# Altium schematic sheet P07_DDR3 Memory.SchDoc
size 386 x 246 mm
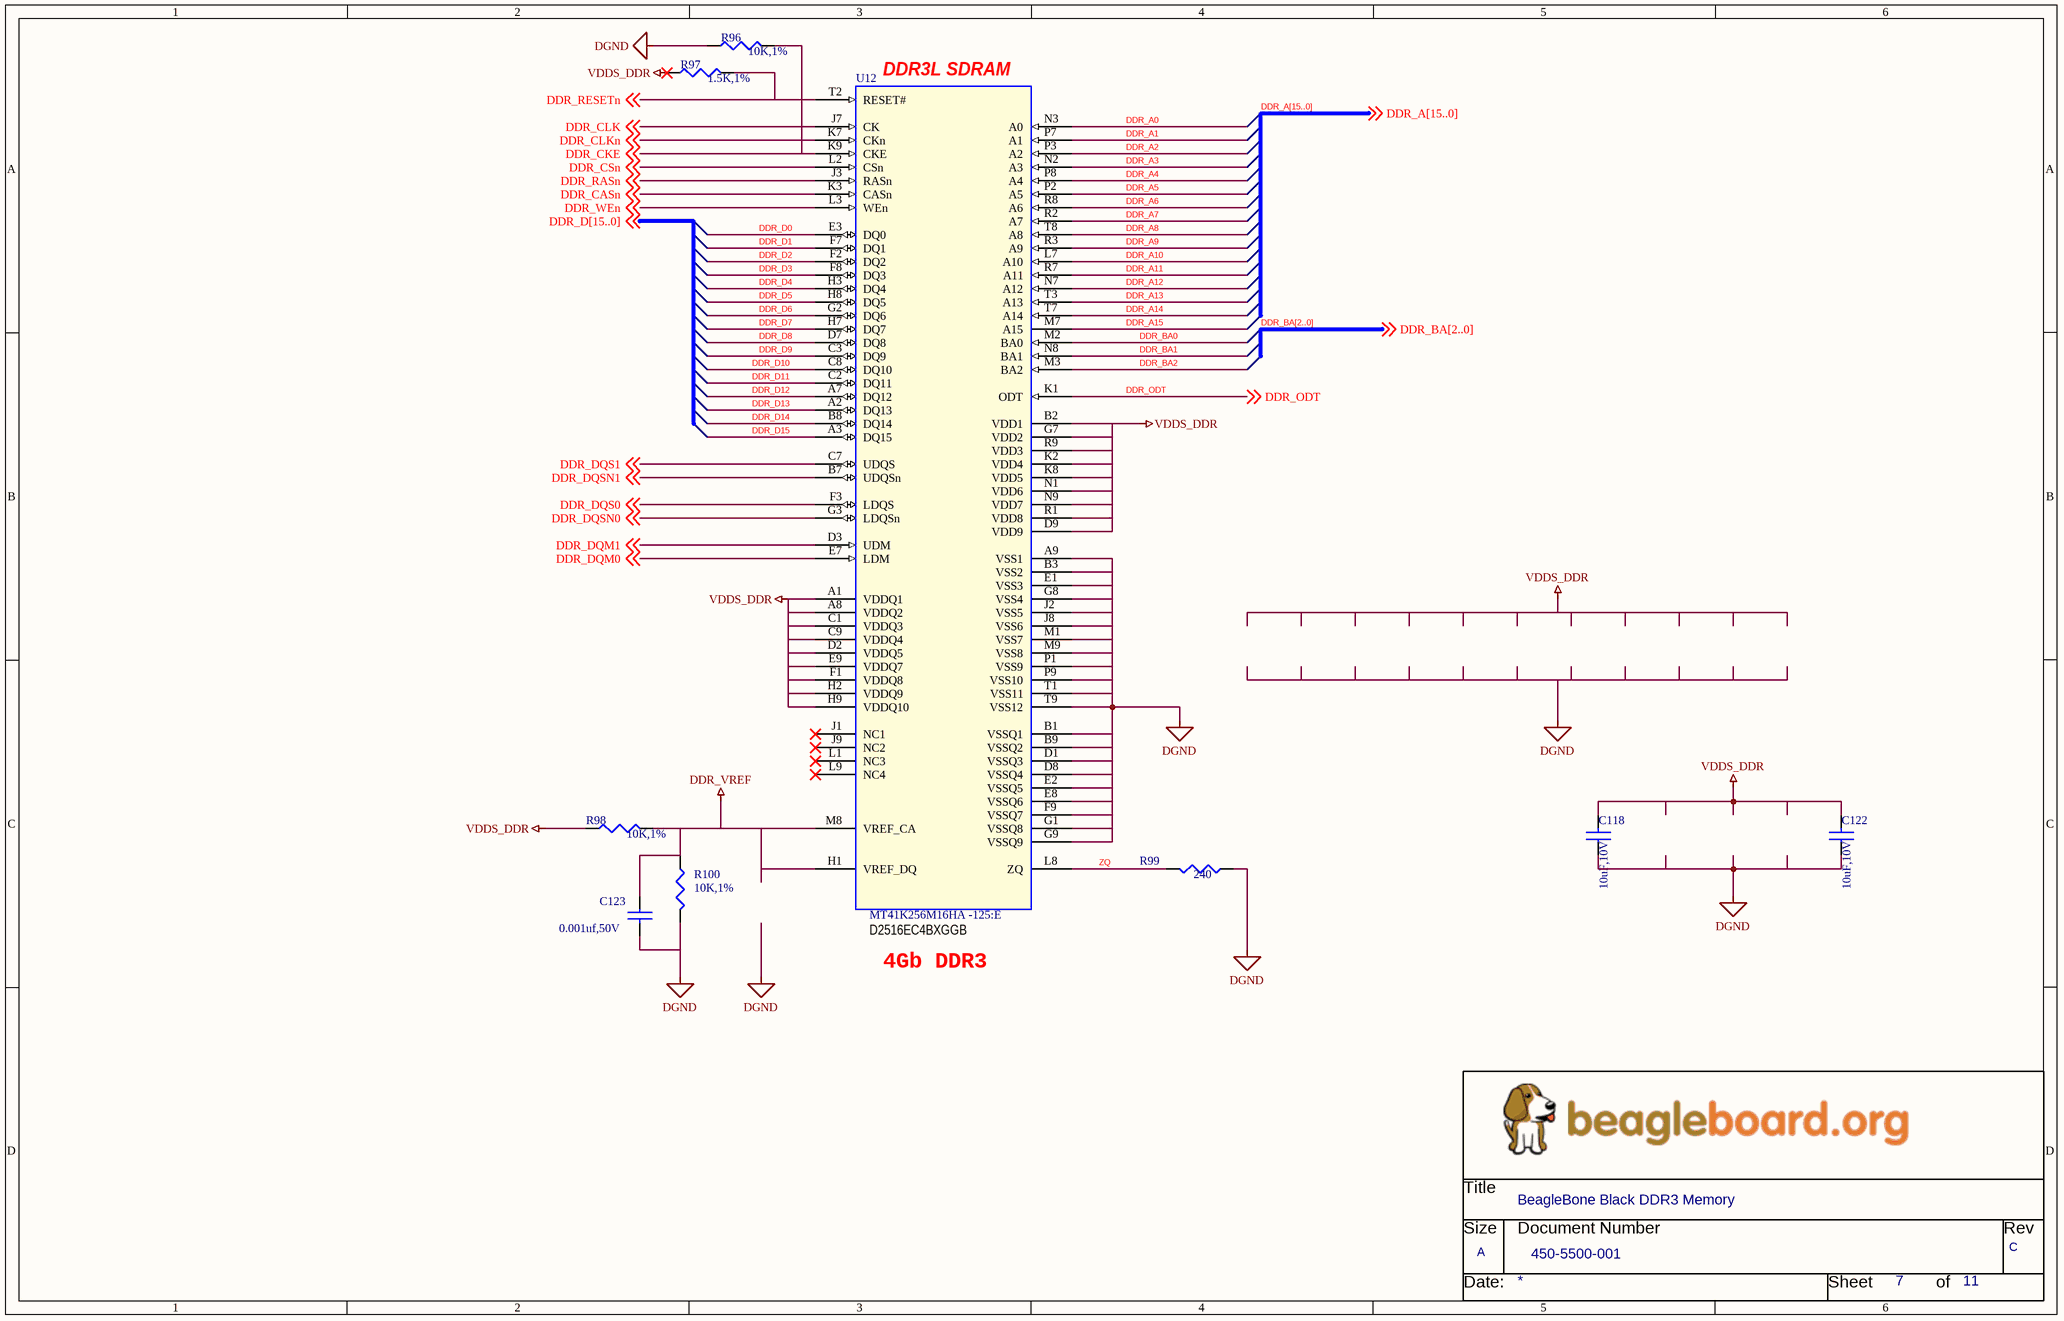
[diagram p0: P07_DDR3 Memory.SchDoc]

## Parts
*  Page Count: 11  Page Number: 7  Page Size: A  Title: BeagleBone Black DDR3 Memory  RevCode: C  Doc: 450-5500-001  (hidden comment: BeagleBoard_org)  (graphical)
C118  10uF,10V  [r402-25rd]
C122  10uF,10V  [r402-25rd]
C123  0.001uf,50V  [402]
R96  10K,1%  [402]
R97  1.5K,1%  [402]
R98  10K,1%  [402]
R99  240  [SM-7351-RES-0402]
R100  10K,1%  [402]
U12  MT41K256M16HA -125:E  [ddr2_fbga60pin]

## Nets
DDR_VREF: C123.1 R98.2 R100.1 U12.H1(VREF_DQ) U12.M8(VREF_CA)
DGND: C118.1 C122.1 C123.2 R96.1 R99.1 R100.2 U12.A9(VSS1) U12.B1(VSSQ1) U12.B3(VSS2) U12.B9(VSSQ2) U12.D1(VSSQ3) U12.D8(VSSQ4) U12.E1(VSS3) U12.E2(VSSQ5) U12.E8(VSSQ6) U12.F9(VSSQ7) U12.G1(VSSQ8) U12.G8(VSS4) U12.G9(VSSQ9) U12.J2(VSS5) U12.J8(VSS6) U12.M1(VSS7) U12.M9(VSS8) U12.P1(VSS9) U12.P9(VSS10) U12.T1(VSS11) U12.T9(VSS12)
VDDS_DDR: C118.2 C122.2 R97.1 R98.1 U12.A1(VDDQ1) U12.A8(VDDQ2) U12.B2(VDD1) U12.C1(VDDQ3) U12.C9(VDDQ4) U12.D2(VDDQ5) U12.D9(VDD9) U12.E9(VDDQ7) U12.F1(VDDQ8) U12.G7(VDD2) U12.H2(VDDQ9) U12.H9(VDDQ10) U12.K2(VDD4) U12.K8(VDD5) U12.N1(VDD6) U12.N9(VDD7) U12.R1(VDD8) U12.R9(VDD3)
DDR_A0: U12.N3(A0)
DDR_A1: U12.P7(A1)
DDR_A2: U12.P3(A2)
DDR_A3: U12.N2(A3)
DDR_A4: U12.P8(A4)
DDR_A5: U12.P2(A5)
DDR_A6: U12.R8(A6)
DDR_A7: U12.R2(A7)
DDR_A8: U12.T8(A8)
DDR_A9: U12.R3(A9)
DDR_A10: U12.L7(A10)
DDR_A11: U12.R7(A11)
DDR_A12: U12.N7(A12)
DDR_A13: U12.T3(A13)
DDR_A14: U12.T7(A14)
DDR_A15: U12.M7(A15)
DDR_BA0: U12.M2(BA0)
DDR_BA1: U12.N8(BA1)
DDR_BA2: U12.M3(BA2)
DDR_CASn: U12.K3(CASn) ; off-sheet DDR_CASn
DDR_CKE: R96.2 U12.K9(CKE) ; off-sheet DDR_CKE
DDR_CLK: U12.J7(CK) ; off-sheet DDR_CLK
DDR_CLKn: U12.K7(CKn) ; off-sheet DDR_CLKn
DDR_CSn: U12.L2(CSn) ; off-sheet DDR_CSn
DDR_D0: U12.E3(DQ0)
DDR_D1: U12.F7(DQ1)
DDR_D2: U12.F2(DQ2)
DDR_D3: U12.F8(DQ3)
DDR_D4: U12.H3(DQ4)
DDR_D5: U12.H8(DQ5)
DDR_D6: U12.G2(DQ6)
DDR_D7: U12.H7(DQ7)
DDR_D8: U12.D7(DQ8)
DDR_D9: U12.C3(DQ9)
DDR_D10: U12.C8(DQ10)
DDR_D11: U12.C2(DQ11)
DDR_D12: U12.A7(DQ12)
DDR_D13: U12.A2(DQ13)
DDR_D14: U12.B8(DQ14)
DDR_D15: U12.A3(DQ15)
DDR_DQM0: U12.E7(LDM) ; off-sheet DDR_DQM0
DDR_DQM1: U12.D3(UDM) ; off-sheet DDR_DQM1
DDR_DQS0: U12.F3(LDQS) ; off-sheet DDR_DQS0
DDR_DQS1: U12.C7(UDQS) ; off-sheet DDR_DQS1
DDR_DQSN0: U12.G3(LDQSn) ; off-sheet DDR_DQSN0
DDR_DQSN1: U12.B7(UDQSn) ; off-sheet DDR_DQSN1
DDR_ODT: U12.K1(ODT) ; off-sheet DDR_ODT
DDR_RASn: U12.J3(RASn) ; off-sheet DDR_RASn
DDR_RESETn: R97.2 U12.T2(RESET#) ; off-sheet DDR_RESETn
DDR_WEn: U12.L3(WEn) ; off-sheet DDR_WEn
ZQ: R99.2 U12.L8(ZQ)

Not connected (* = marked no-connect by the designer): U12 J1(NC1)* J9(NC2)* L1(NC3)* L9(NC4)*

## Buses and harness runs
bus DDR_A[15..0]
bus DDR_BA[2..0]

## Notes on the sheet
- (near U12) DDR3L SDRAM
- D2516EC4BXGGB
- 4Gb DDR3
- (in symbol BeagleBoard_org) Title; Size; Document Number; Rev; Date:; Sheet; of

## Library data of the parts
C118 C122 = CAP_10uF_Y5V_10V_10%_0805: Desc: CAP CER 10UF 10V Y5V 0805; PCB Footprint: 805; Part Number: CAP_10uF_Y5V_10V_10%_0805
C123 = CAP_0.001_X7R_50V_5%_0402: Part Number: CAP_0.001uf_X7R_50V_0402; Desc: Capacitor 0.001uF 50V 5% 0402; PCB Footprint: 402
R96 R97 = RES_10K_1/16W_1%_0402: Resistor 10Kohm 1/16W 1% 0402; Part Number: RES_10K_1/16W_1%_0402; PCB Footprint: 402
R98 R100 = RES_10K_1/16W_1%_0402_Dup1: Resistor 10Kohm 1/16W 1% 0402; Part Number: RES_10K_1/16W_1%_0402; PCB Footprint: 402
R99 = Res: Res, 240E, 1%, Thick Film, 0.1W, SMD, Size 0402; PartName: 240E1/10W1%smd0402; MfrNum: ERJ-2RKF2400X; Mfr: Panasonic-ECG; DescriptiveText: RES 240 OHM 1/10W 1% 0402 SMD; Mfg: KOA; PCB Footprint: SM-7351-RES-0402; Created Date: 4/12/2010; Created By: Sankar; Sub_Type: Thick Film; Tolerance: 1%
U12 = MT47H256M8_7: PartName: MT41J256M16RE-15E; Mfr: Micron; DescriptiveText: DDR3 Memory 4Gb; PCB Footprint: BGA96_T9_P8_9X14; MfrNum: MT41J256M16RE-15E
* = BeagleBoard_org: Page Create Date: March  8, 1995; Page Modify Date: *